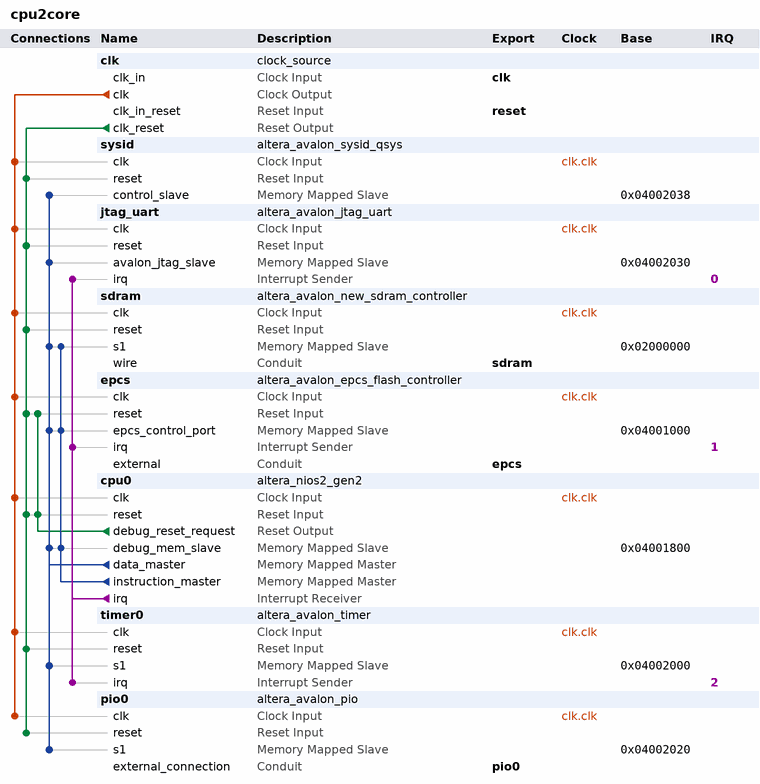
[diagram p0: system contents]
# Platform Designer (Qsys) system cpu2core, Cyclone IV E EP4CE15F17C8
# Parameters at their usual value, and those the tool derives, are not listed.
package require -exact qsys 14.1
create_system cpu2core
set_project_property DEVICE_FAMILY {Cyclone IV E}
set_project_property DEVICE EP4CE15F17C8

add_instance clk clock_source 14.1
set_instance_parameter_value clk clockFrequency 50000000

add_instance sysid altera_avalon_sysid_qsys 14.1
set_instance_parameter_value sysid id 0

add_instance jtag_uart altera_avalon_jtag_uart 14.1
set_instance_parameter_value jtag_uart simInteractiveOptions NO_INTERACTIVE_WINDOWS

add_instance sdram altera_avalon_new_sdram_controller 14.1
set_instance_parameter_value sdram TAC 5.5
set_instance_parameter_value sdram TRCD 20.0
set_instance_parameter_value sdram TRP 20.0
set_instance_parameter_value sdram casLatency 3
set_instance_parameter_value sdram columnWidth 9
set_instance_parameter_value sdram dataWidth 16
set_instance_parameter_value sdram generateSimulationModel false
set_instance_parameter_value sdram model single_Micron_MT48LC4M32B2_7_chip
set_instance_parameter_value sdram numberOfBanks 4
set_instance_parameter_value sdram numberOfChipSelects 1
set_instance_parameter_value sdram powerUpDelay 100.0
set_instance_parameter_value sdram refreshPeriod 15.625
set_instance_parameter_value sdram rowWidth 13

add_instance epcs altera_avalon_epcs_flash_controller 14.1
set_instance_parameter_value epcs resetrequest_enabled false

add_instance cpu0 altera_nios2_gen2 14.1
set_instance_parameter_value cpu0 dcache_size 0
set_instance_parameter_value cpu0 exceptionSlave sdram.s1
set_instance_parameter_value cpu0 icache_size 4096
set_instance_parameter_value cpu0 impl Fast
set_instance_parameter_value cpu0 resetSlave epcs.epcs_control_port

add_instance timer0 altera_avalon_timer 14.1
set_instance_parameter_value timer0 period 1
set_instance_parameter_value timer0 periodUnits MSEC

add_instance pio0 altera_avalon_pio 14.1
set_instance_parameter_value pio0 direction Output
set_instance_parameter_value pio0 width 2

# connections
add_connection clk.clk cpu0.clk clock
add_connection clk.clk epcs.clk clock
add_connection clk.clk jtag_uart.clk clock
add_connection clk.clk pio0.clk clock
add_connection clk.clk sdram.clk clock
add_connection clk.clk sysid.clk clock
add_connection clk.clk timer0.clk clock
add_connection clk.clk_reset cpu0.reset reset
add_connection clk.clk_reset epcs.reset reset
add_connection clk.clk_reset jtag_uart.reset reset
add_connection clk.clk_reset pio0.reset reset
add_connection clk.clk_reset sdram.reset reset
add_connection clk.clk_reset sysid.reset reset
add_connection clk.clk_reset timer0.reset reset
add_connection cpu0.debug_reset_request cpu0.reset reset
add_connection cpu0.debug_reset_request epcs.reset reset
add_connection cpu0.data_master cpu0.debug_mem_slave avalon
set_connection_parameter_value cpu0.data_master/cpu0.debug_mem_slave baseAddress 0x04001800
add_connection cpu0.data_master epcs.epcs_control_port avalon
set_connection_parameter_value cpu0.data_master/epcs.epcs_control_port baseAddress 0x04001000
add_connection cpu0.data_master jtag_uart.avalon_jtag_slave avalon
set_connection_parameter_value cpu0.data_master/jtag_uart.avalon_jtag_slave baseAddress 0x04002030
add_connection cpu0.data_master pio0.s1 avalon
set_connection_parameter_value cpu0.data_master/pio0.s1 baseAddress 0x04002020
add_connection cpu0.data_master sdram.s1 avalon
set_connection_parameter_value cpu0.data_master/sdram.s1 baseAddress 0x02000000
add_connection cpu0.data_master sysid.control_slave avalon
set_connection_parameter_value cpu0.data_master/sysid.control_slave baseAddress 0x04002038
add_connection cpu0.data_master timer0.s1 avalon
set_connection_parameter_value cpu0.data_master/timer0.s1 baseAddress 0x04002000
add_connection cpu0.instruction_master cpu0.debug_mem_slave avalon
set_connection_parameter_value cpu0.instruction_master/cpu0.debug_mem_slave baseAddress 0x04001800
add_connection cpu0.instruction_master epcs.epcs_control_port avalon
set_connection_parameter_value cpu0.instruction_master/epcs.epcs_control_port baseAddress 0x04001000
add_connection cpu0.instruction_master sdram.s1 avalon
set_connection_parameter_value cpu0.instruction_master/sdram.s1 baseAddress 0x02000000
add_connection cpu0.irq epcs.irq interrupt
set_connection_parameter_value cpu0.irq/epcs.irq irqNumber 1
add_connection cpu0.irq jtag_uart.irq interrupt
set_connection_parameter_value cpu0.irq/jtag_uart.irq irqNumber 0
add_connection cpu0.irq timer0.irq interrupt
set_connection_parameter_value cpu0.irq/timer0.irq irqNumber 2

# exported interfaces
add_interface clk clock sink
set_interface_property clk EXPORT_OF clk.clk_in
add_interface epcs conduit end
set_interface_property epcs EXPORT_OF epcs.external
add_interface pio0 conduit end
set_interface_property pio0 EXPORT_OF pio0.external_connection
add_interface reset reset sink
set_interface_property reset EXPORT_OF clk.clk_in_reset
add_interface sdram conduit end
set_interface_property sdram EXPORT_OF sdram.wire

set_interconnect_requirement {$system} qsys_mm.clockCrossingAdapter HANDSHAKE
set_interconnect_requirement {$system} qsys_mm.insertDefaultSlave FALSE
set_interconnect_requirement {$system} qsys_mm.maxAdditionalLatency 1

save_system cpu2core.qsys
